# Altium schematic sheet Bluetooth.SchDoc
size A3 portrait
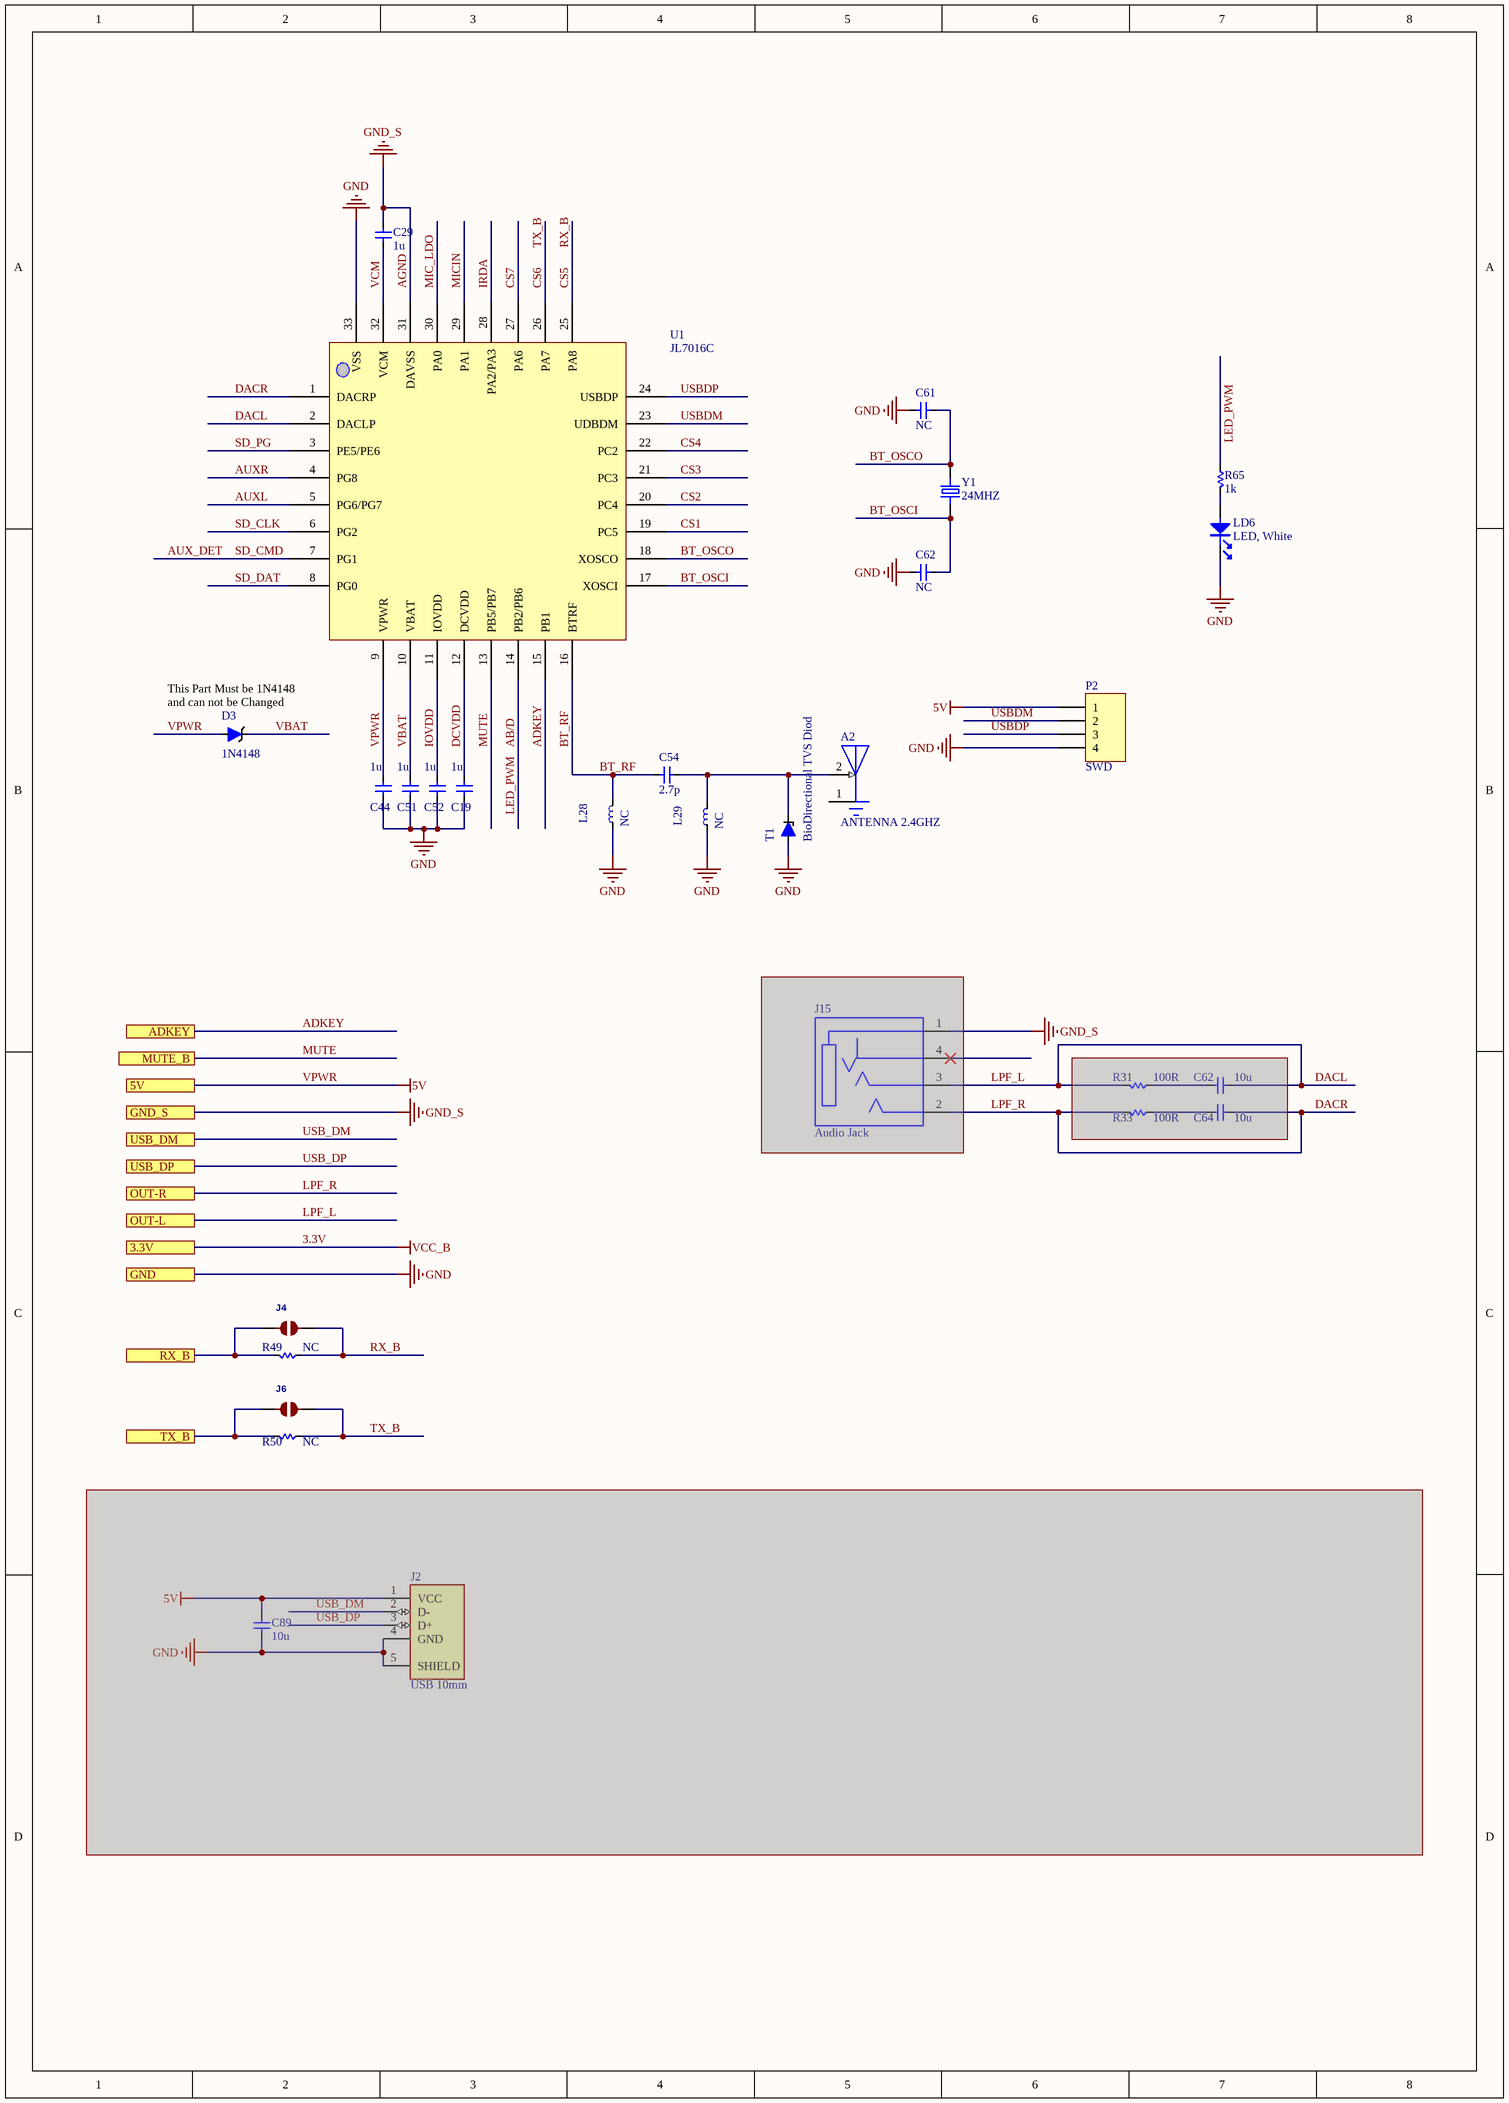
[diagram p0: Bluetooth.SchDoc]

## Parts
(Parts that share a designator on the sheet are numbered #1, #2 ... from top to bottom, then left to right.)
A2  ANTENNA 2.4GHZ  [ANTENNA 2.4GHZ - TI]
C19  1u  [cap0603]
C29  1u  [cap0603]
C44  1u  [cap0603]
C51  1u  [cap0603]
C52  1u  [cap0603]
C54  2.7p  [cap0603]
C61  NC  [cap0603]
C62#1  NC  [cap0603]
C62#2  10u  [CAP 0805]  (masked out: inside a compile mask, not in the netlist)
C64  10u  [CAP 0805]  (masked out: inside a compile mask, not in the netlist)
C89  10u  [CAP 0805]  (masked out: inside a compile mask, not in the netlist)
D3  1N4148  [1N4148 SOD-123]
J2  USB 10mm  [USB SMALL]  (masked out: inside a compile mask, not in the netlist)
J4  SOLDERJUMPER  [SOLDERJUMPER_ARROW_NOPASTE]  (value not drawn)
J6  SOLDERJUMPER  [SOLDERJUMPER_ARROW_NOPASTE]  (value not drawn)
J15  Audio Jack  [Audio jack_ CUI_SJ2-3574A-SMT-TR]  (masked out: inside a compile mask, not in the netlist)
L28  NC  [inductor 0603]
L29  NC  [inductor 0603]
LD6  LED, White  [LED-0603-BLUE]
P2  SWD  [HDR1X4H]
R31  100R  [RES-0603]  (masked out: inside a compile mask, not in the netlist)
R33  100R  [RES-0603]  (masked out: inside a compile mask, not in the netlist)
R49  NC  [RES-0603]
R50  NC  [RES-0603]
R65  1k  [RES-0603]
T1  BioDirectional TVS Diod  [SMAJ3.3A]
U1  JL7016C  [JL7016C]
Y1  24MHZ  [crystal b]

## Ports
3.3V, 5V, ADKEY, GND, GND_S, MUTE_B, OUT-L, OUT-R, RX_B, TX_B, USB_DM, USB_DP

## Nets
3.3V: port 3.3V  [also labelled VCC_B]
AGND: C29.2 U1.31(DAVSS) ; port GND_S  [also labelled GND_S]
GND: C19.2 C44.2 C51.2 C52.2 C61.1 C62#1.2 L28.2 L29.2 LD6.1 P2.4 T1.A U1.33(VSS) ; port GND
VPWR: C44.1 D3.1(A) P2.1 U1.9(VPWR) ; port 5V  [also labelled 5V]
AB/D: R65.1 U1.14(PB2/PB6)  [also labelled LED_PWM]
ADKEY: U1.15(PB1) ; port ADKEY
AUX_DET: U1.7(PG1)  [also labelled SD_CMD]
AUXL: U1.5(PG6/PG7)
AUXR: U1.4(PG8)
BT_OSCI: C62#1.1 U1.17(XOSCI) Y1.1
BT_OSCO: C61.2 U1.18(XOSCO) Y1.2
BT_RF: C54.2 L28.1 U1.16(BTRF)
CS1: U1.19(PC5)
CS2: U1.20(PC4)
CS3: U1.21(PC3)
CS4: U1.22(PC2)
CS5: J4.2 R49.1 U1.25(PA8)  [also labelled RX_B]
CS6: J6.2 R50.1 U1.26(PA7)  [also labelled TX_B]
CS7: U1.27(PA6)
DACL: U1.2(DACLP) ; port OUT-L  [also labelled LPF_L]
DACR: U1.1(DACRP) ; port OUT-R  [also labelled LPF_R]
DCVDD: C19.1 U1.12(DCVDD)
IOVDD: C52.1 U1.11(IOVDD)
IRDA: U1.28(PA2/PA3)
MIC_LDO: U1.30(PA0)
MICIN: U1.29(PA1)
MUTE: U1.13(PB5/PB7) ; port MUTE_B
RX_B: J4.1 R49.2 ; port RX_B
SD_CLK: U1.6(PG2)
SD_DAT: U1.8(PG0)
SD_PG: U1.3(PE5/PE6)
TX_B: J6.1 R50.2 ; port TX_B
USB_DM: port USB_DM
USB_DP: port USB_DP
USBDM: P2.2 U1.23(UDBDM)
USBDP: P2.3 U1.24(USBDP)
VBAT: C51.1 D3.2(C) U1.10(VBAT)
VCM: C29.1 U1.32(VCM)
NetA2_2: A2.2(FEED) C54.1 L29.1 T1.C
NetLD6_2: LD6.2 R65.2

Not connected (* = marked no-connect by the designer): A2 1(GND)

## Notes on the sheet
- (near D3) This Part Must be 1N4148 and can not be Changed
- Title
- Size:
- Date:
- File:
- A2
- Number:
- Time:
- Revision:
- Sheet
- of

## Library data of the parts
A2 = ANTENNA 2.4GHZ: ESP32 ANTENNA; MP: PRO-OB-440; MF: Proant AB; SnapEDA_Link: https://www.snapeda.com/parts/PRO-OB-440/Proant%20AB/view-part/2307534/?ref=snap; Digi-Key_Purchase_URL: https://www.digikey.com/product-detail/en/proant-ab/PRO-OB-440/1532-1001-1-ND/4895684?utm_source=snapeda&utm_medium=aggregator&utm_campaign=symbol; Value: *; Package: None; Digi-Key_Part_Number: 1532-1001-1-ND
C19 C29 C44 C51 C52 C54 C61 C62#1 = Cap 0603: Capacitor 0603; Value: 104; Published: 8-Jun-2000; LatestRevisionDate: 17-Jul-2002; LatestRevisionNote: Re-released for DXP Platform.; Publisher: Altium Limited
C62#2 C64 C89 = Cap 0805: Capacitor 0805; Value: 104; Published: 8-Jun-2000; LatestRevisionDate: 17-Jul-2002; LatestRevisionNote: Re-released for DXP Platform.; Publisher: Altium Limited
D3 = 1N4148_SOD123: SOD-123 Package; MP: EDZV12B; MF: ROHM Semiconductor; Price: None; Package: None; SnapEDA_Link: https://www.snapeda.com/parts/EDZV12B/EMI/view-part/4479349/?ref=snap; Availability: Unavailable; Value: *
J2 = usb a small: UJ2-AV-1-SMT usb a vertical  small; MF: {'manufacturer': u'CUI Devices'}; Package: None; Value: *; Availability: Unavailable; MP: UJ2-AV-1-SMT; Price: None
J4 J6 = SOLDERJUMPER: SMD Solder JUMPERSolder the two pads together to create a connection, or remove the solder to break it.REFLOW - Use this footprint for solder paste and reflow ovens.WAVE - Use this footprint for hand-soldering (larger pads). CLOSED - Has a trace between the two pads to ensure it is closed by default.  The trace needs to be cut to disable the jumper, and can be closed again by creating a solder bridge between the two pads.; GateName_1: 1; BOM: EXCLUDE; SymbolName_1: SOLDERJUMPER; LibraryName: microbuilder; DeviceSetName: SOLDERJUMPER
J15 = Audio Jack _ SJ2-3574A-SMT-TR: 3.5 mm, Stereo, Right Angle, Surface Mount _SMT_, Audio Jack Connector; MF: CUI Devices; Package: None; Value: *; Availability: Unavailable; SnapEDA_Link: https://www.snapeda.com/parts/SJ2-3574A-SMT-TR/CUI%20Devices/view-part/648175/?ref=snap; Price: None; MP: SJ2-3574A-SMT-TR
L28 L29 = INDUCTOR_SMD: Inductor smd; MP: DR127-330-R; MF: Eaton; Price: None; Package: Nonstandard Eaton; Availability: Unavailable; SnapEDA_Link: https://www.snapeda.com/parts/DR127-330-R/Eaton/view-part/?ref=snap; Value: *
LD6 = LED_blue: LED, Blue, 0603; Manuf_1: everlight; Manuf_Part_1: 19-213-R6C-AP1Q2B/3T; ECCN_US/EU: EAR99/NEC; Order: 19-213-R6C-AP1Q2B/3T
P2 = Header 4: Header, 4-Pin; LatestRevisionDate: 17-Jul-2002; LatestRevisionNote: Re-released for DXP Platform.; Publisher: Altium Limited
R31 R33 R49 R50 R65 = Res 0603: Resistor 0603; Published: 8-Jun-2000; LatestRevisionDate: 29-May-2009; LatestRevisionNote: IPC-7351 Footprint Added.; PackageReference: J1-0603; Publisher: Altium Limited; PackageDescription: Chip Resistor
  R31 R33: Value: *
T1 = SMAJ3.3A: one side TVS Diode; MP: EDZV12B; MF: ROHM Semiconductor; Price: None; Package: None; SnapEDA_Link: https://www.snapeda.com/parts/EDZV12B/EMI/view-part/4479349/?ref=snap; Availability: Unavailable; Value: *
U1 = JL7016C: BlE Chip
Y1 = crystal b: 13MHz Â±30ppm Crystal 20pF 60 Ohms HC-49/US  ECS-130-20-3X-TR; MF: ECS Inc.; Value: *; SnapEDA_Link: https://www.snapeda.com/parts/ECS-130-20-3X-TR/ECS%20Inc./view-part/2459108/?ref=snap; MP: ECS-130-20-3X-TR; Check_prices: https://www.snapeda.com/parts/ECS-130-20-3X-TR/ECS%20Inc./view-part/2459108/?ref=eda; Purchase-URL: https://pricing.snapeda.com/search/part/ECS-130-20-3X-TR/?ref=eda; Availability: Warning; Price: None; Package: HC49/US ECS International